# Altium schematic sheet Switches_V2.SchDoc
size A4
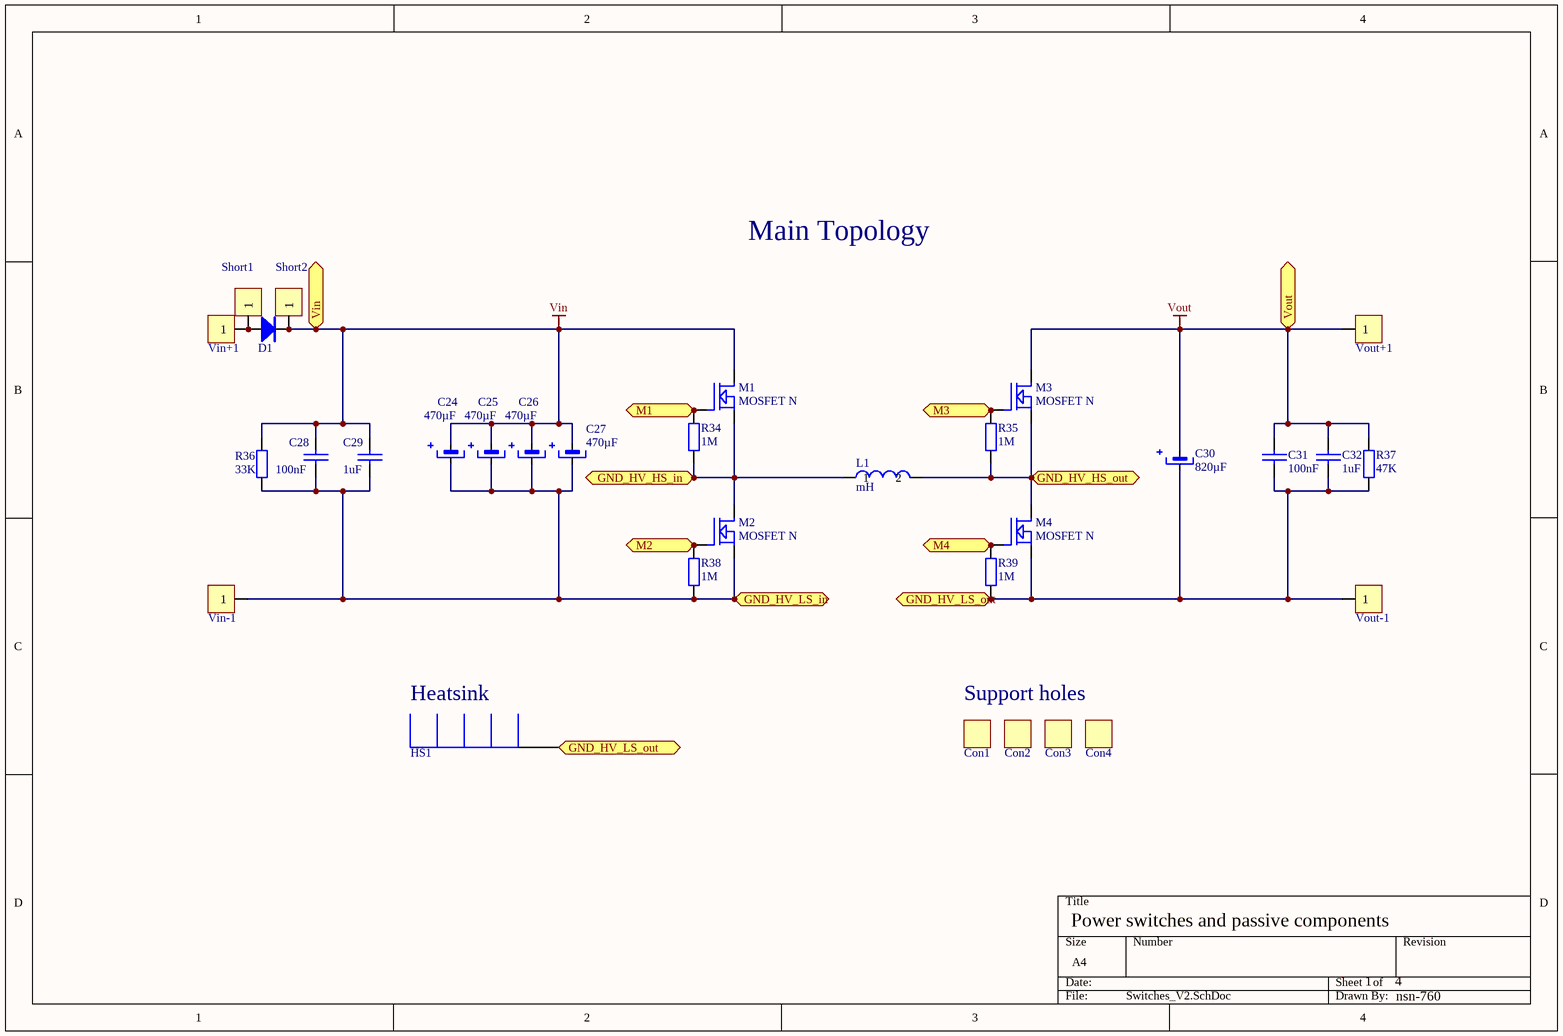
[diagram p0: Switches_V2.SchDoc]

## Parts
C24  470µF  [CE_16Dx35mm_pitch7.5mm]
C25  470µF  [CE_16Dx35mm_pitch7.5mm]
C26  470µF  [CE_16Dx35mm_pitch7.5mm]
C27  470µF  [CE_16Dx35mm_pitch7.5mm]
C28  100nF  [1812]
C29  1uF  [1812]
C30  820µF  [CE_30Dx35mm_pitch10mm]
C31  100nF  [1812]
C32  1uF  [1812]
Con1  Support  [Support]  (value not drawn)
Con2  Support  [Support]  (value not drawn)
Con3  Support  [Support]  (value not drawn)
Con4  Support  [Support]  (value not drawn)
D1  ????  [D2PAK - Diode]  (value not drawn)
HS1  Heatsink  [Heatsink60x60]
L1  mH  [Torus_Coil_1mH]
M1  MOSFET N  [D2PAK - MOSFET]
M2  MOSFET N  [D2PAK - MOSFET]
M3  MOSFET N  [D2PAK - MOSFET]
M4  MOSFET N  [D2PAK - MOSFET]
R34  1M  [1206]
R35  1M  [1206]
R36  33K  [1206]
R37  47K  [1206]
R38  1M  [1206]
R39  1M  [1206]
Short1  CON1  [ShortPad]  (value not drawn)
Short2  CON1  [ShortPad]  (value not drawn)
Vin+1  CON1  [PowerHole]  (value not drawn)
Vin-1  CON1  [PowerHole]  (value not drawn)
Vout+1  CON1  [PowerHole]  (value not drawn)
Vout-1  CON1  [PowerHole]  (value not drawn)

## Ports
GND_HV_HS_in, GND_HV_HS_out, GND_HV_LS_in, GND_HV_LS_out, M1, M2, M3, M4, Vin, Vout

## Nets
Vin: C24.1 C25.1 C26.1 C27.1 C28.1 C29.1 D1.K M1.D R36.1 Short2.1 ; port Vin
Vout: C30.1 C31.1 C32.1 M3.D R37.1 Vout+1.1 ; port Vout
GND_HV_HS_in: L1.1 M1.S M2.D R34.2 ; port GND_HV_HS_in
GND_HV_HS_out: L1.2 M3.S M4.D R35.2 ; port GND_HV_HS_out
GND_HV_LS_in: C24.2 C25.2 C26.2 C27.2 C28.2 C29.2 M2.S R36.2 R38.2 Vin-1.1 ; port GND_HV_LS_in
GND_HV_LS_out: C30.2 C31.2 C32.2 HS1.1 M4.S R37.2 R39.2 Vout-1.1 ; port GND_HV_LS_out
M1: M1.G R34.1 ; port M1
M2: M2.G R38.1 ; port M2
M3: M3.G R35.1 ; port M3
M4: M4.G R39.1 ; port M4
NetD1_A: D1.A Short1.1 Vin+1.1

## Notes on the sheet
- Main Topology
- Support holes
- Power switches and passive components
- 1
- 4
- nsn-760

## Library data of the parts
C24-C27 C30 = Cond_Electrolítico: Condensador Aluminio con polaridad
C28 C29 C31 C32 = Condensador
D1 = Diodo
L1 = Bobina
M1-M4 = MOSFET N: MOSFET de canal N
R34-R39 = Resistencia: Potencia: 1/4W